# Altium schematic sheet DriverBoardForCNC.SchDoc: Driver Board For CNC
size A3; Author: veres; CompanyName: VR; DrawnBy: Vladimir; Engineer: Vladimir; Organization: Vladimir Tyrkin; Address1: veres.pcb@gmail.com; DocumentNumber: 001; Revision: 2.0; SheetNumber: 1; SheetTotal: 1
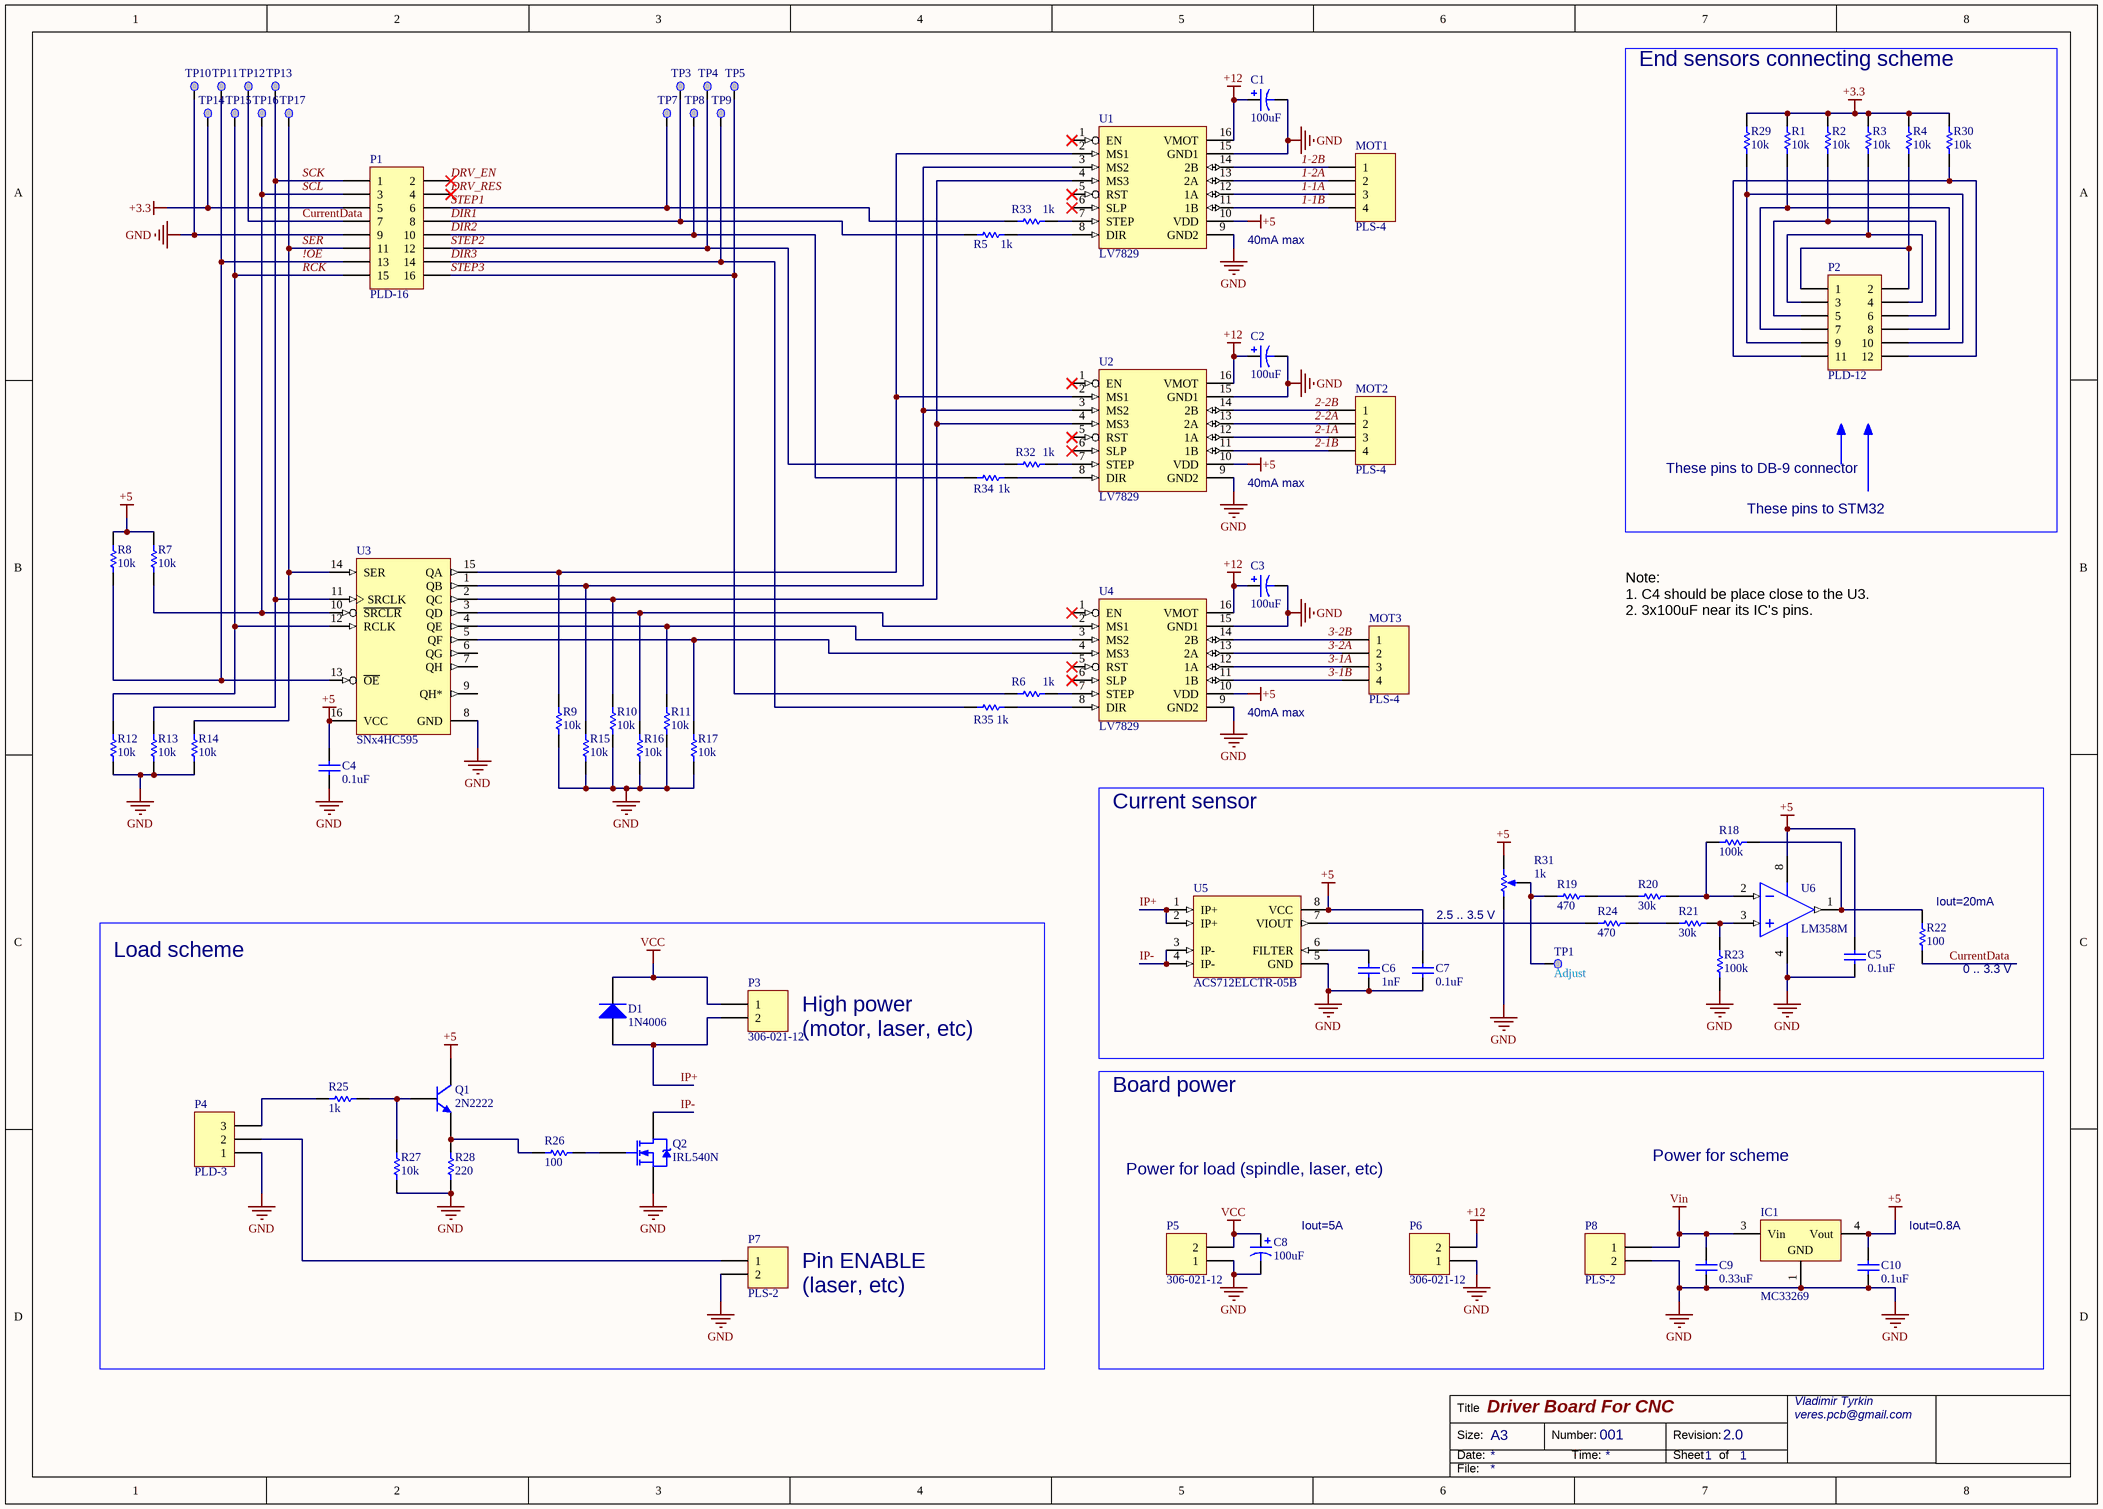
[diagram p0: DriverBoardForCNC.SchDoc]

## Parts
C1  value 100uF  [UD-6,3X5,8_NICHICON]  (hidden comment: Cap Pol)
C2  value 100uF  [UD-6,3X5,8_NICHICON]  (hidden comment: Cap Pol)
C3  value 100uF  [UD-6,3X5,8_NICHICON]  (hidden comment: Cap Pol)
C4  value 0.1uF  [C1206]  (hidden comment: Cap)
C5  value 0.1uF  [C1206]  (hidden comment: Cap)
C6  value 1nF  [C0805]  (hidden comment: Cap)
C7  value 0.1uF  [C1206]  (hidden comment: Cap)
C8  value 100uF  [UD-6,3X5,8_NICHICON]  (hidden comment: Cap Pol)
C9  value 0.33uF  [C1206]  (hidden comment: Cap)
C10  value 0.1uF  [C1206]  (hidden comment: Cap)
D1  1N4006  [DO-41]
IC1  MC33269  [DPAK]
MOT1  PLS-4  [HDR1X4]
MOT2  PLS-4  [HDR1X4]
MOT3  PLS-4  [HDR1X4]
P1  PLD-16  [HDR2X8]
P2  PLD-12  [HDR2X6]
P3  306-021-12  [W237-102]
P4  PLD-3  [HDR1X3]
P5  306-021-12  [W237-102]
P6  306-021-12  [W237-102]
P7  PLS-2  [HDR1X2]
P8  PLS-2  [HDR1X2]
Q1  2N2222  [TO92]
Q2  IRL540N  [TO220BV]
R1  10k  [RES-0805]
R2  10k  [RES-0805]
R3  10k  [RES-0805]
R4  10k  [RES-0805]
R5  1k  [RES-0805]
R6  1k  [RES-0805]
R7  10k  [RES-0805]
R8  10k  [RES-0805]
R9  10k  [RES-0805]
R10  10k  [RES-0805]
R11  10k  [RES-0805]
R12  10k  [RES-0805]
R13  10k  [RES-0805]
R14  10k  [RES-0805]
R15  10k  [RES-0805]
R16  10k  [RES-0805]
R17  10k  [RES-0805]
R18  100k  [RES-0805]
R19  470  [RES-0805]
R20  30k  [RES-0805]
R21  30k  [RES-0805]
R22  100  [RES-0805]
R23  100k  [RES-0805]
R24  470  [RES-1206]
R25  1k  [RES-0805]
R26  100  [RES-0805]
R27  10k  [RES-0805]
R28  220  [RES-0805]
R29  10k  [RES-0805]
R30  10k  [RES-0805]
R31  1k  [VR5]
R32  1k  [RES-0805]
R33  1k  [RES-0805]
R34  1k  [RES-0805]
R35  1k  [RES-0805]
TP1  Adjust  [TestPoint]  (no BOM)
TP3  (no value)  [TP_SMD_1MM]  (no BOM)
TP4  (no value)  [TP_SMD_1MM]  (no BOM)
TP5  (no value)  [TP_SMD_1MM]  (no BOM)
TP7  (no value)  [TP_SMD_1MM]  (no BOM)
TP8  (no value)  [TP_SMD_1MM]  (no BOM)
TP9  (no value)  [TP_SMD_1MM]  (no BOM)
TP10  (no value)  [TP_SMD_1MM]  (no BOM)
TP11  (no value)  [TP_SMD_1MM]  (no BOM)
TP12  (no value)  [TP_SMD_1MM]  (no BOM)
TP13  (no value)  [TP_SMD_1MM]  (no BOM)
TP14  (no value)  [TP_SMD_1MM]  (no BOM)
TP15  (no value)  [TP_SMD_1MM]  (no BOM)
TP16  (no value)  [TP_SMD_1MM]  (no BOM)
TP17  (no value)  [TP_SMD_1MM]  (no BOM)
U1  LV7829  [LV8729_BREAKOUT]
U2  LV7829  [LV8729_BREAKOUT]
U3  SNx4HC595  [SO16]
U4  LV7829  [LV8729_BREAKOUT]
U5  value ACS712ELCTR-05B  [SO-8_L]  (hidden comment: Current Sensor)
U6  LM358M  [SO-8_L]

## Blocks framed on the sheet
End sensors connecting scheme: P2 R1-R4 R29 R30
Current sensor: C5-C7 R18-R24 R31 TP1 U5 U6
Load scheme: D1 P3 P4 P7 Q1 Q2 R25-R28
Board power: C8-C10 IC1 P5 P6 P8

## Nets
+3.3: P1.5 R1.1 R2.1 R3.1 R4.1 R29.1 R30.1 TP14.1
+5: C4.2 C5.1 C7.2 C10.2 IC1.4(Vout) Q1.1(C) R7.1 R8.1 R31.3(BOT) U1.10(VDD) U2.10(VDD) U3.16(VCC) U4.10(VDD) U5.8(VCC) U6.8(V+)
+12: C1.1 C2.1 C3.1 P6.2 U1.16(VMOT) U2.16(VMOT) U4.16(VMOT)
GND: C1.2 C2.2 C3.2 C4.1 C5.2 C6.1 C7.1 C8.2 C9.1 C10.1 IC1.1(GND) P1.9 P4.1 P5.1 P6.1 P7.2 P8.2 Q2.3(S) R9.2 R10.2 R11.2 R12.2 R13.2 R14.2 R15.2 R16.2 R17.2 R23.2 R27.2 R28.2 R31.1(TOP) TP10.1 U1.9(GND2) U1.15(GND1) U2.9(GND2) U2.15(GND1) U3.8(GND) U4.9(GND2) U4.15(GND1) U5.5(GND) U6.4(V-)
VCC: C8.1 D1.2(K) P3.1 P5.2
Vin: C9.2 IC1.3(Vin) P8.1
1-1A: MOT1.3 U1.12(1A)
1-1B: MOT1.4 U1.11(1B)
1-2A: MOT1.2 U1.13(2A)
1-2B: MOT1.1 U1.14(2B)
2-1A: MOT2.3 U2.12(1A)
2-1B: MOT2.4 U2.11(1B)
2-2A: MOT2.2 U2.13(2A)
2-2B: MOT2.1 U2.14(2B)
3-1A: MOT3.3 U4.12(1A)
3-1B: MOT3.4 U4.11(1B)
3-2A: MOT3.2 U4.13(2A)
3-2B: MOT3.1 U4.14(2B)
!OE: P1.13 R8.2 TP11.1 U3.13(~{OE})
CurrentData: P1.7 R22.2 TP12.1
DIR1: P1.8 R5.2 TP3.1
DIR2: P1.10 R34.2 TP8.1
DIR3: P1.14 R35.2 TP9.1
DRV_EN: P1.2
DRV_RES: P1.4
IP+: D1.1(A) P3.2 U5.1(IP+) U5.2(IP+)
IP-: Q2.2(D) U5.3(IP-) U5.4(IP-)
RCK: P1.15 R12.1 TP15.1 U3.12(RCLK)
SCK: P1.1 R13.1 TP13.1 U3.11(SRCLK)
SCL: P1.3 R7.2 TP16.1 U3.10(~{SRCLR})
SER: P1.11 R14.1 TP17.1 U3.14(SER)
STEP1: P1.6 R33.2 TP7.1
STEP2: P1.12 R32.2 TP4.1
STEP3: P1.16 R6.2 TP5.1
NetC6_2: C6.2 U5.6(FILTER)
NetP2_1: P2.1 P2.2 R4.2
NetP2_3: P2.3 P2.4 R3.2
NetP2_5: P2.5 P2.6 R2.2
NetP2_7: P2.7 P2.8 R1.2
NetP2_9: P2.9 P2.10 R29.2
NetP2_11: P2.11 P2.12 R30.2
NetP4_2: P4.2 P7.1
NetP4_3: P4.3 R25.2
NetQ1_2: Q1.2(B) R25.1 R27.1
NetQ1_3: Q1.3(E) R26.2 R28.1
NetQ2_1: Q2.1(G) R26.1
NetR5_1: R5.1 U1.8(DIR)
NetR6_1: R6.1 U4.7(STEP)
NetR9_1: R9.1 U1.2(MS1) U2.2(MS1) U3.15(QA)
NetR10_1: R10.1 U1.4(MS3) U2.4(MS3) U3.2(QC)
NetR11_1: R11.1 U3.4(QE) U4.3(MS2)
NetR15_1: R15.1 U1.3(MS2) U2.3(MS2) U3.1(QB)
NetR16_1: R16.1 U3.3(QD) U4.2(MS1)
NetR17_1: R17.1 U3.5(QF) U4.4(MS3)
NetR18_1: R18.1 R20.1 U6.2(IN-)
NetR18_2: R18.2 R22.1 U6.1(OUT)
NetR19_1: R19.1 R31.2(TAP) TP1.1
NetR19_2: R19.2 R20.2
NetR21_1: R21.1 R23.1 U6.3(IN+)
NetR21_2: R21.2 R24.2
NetR24_1: R24.1 U5.7(VIOUT)
NetR32_1: R32.1 U2.7(STEP)
NetR33_1: R33.1 U1.7(STEP)
NetR34_1: R34.1 U2.8(DIR)
NetR35_1: R35.1 U4.8(DIR)

Not connected (* = marked no-connect by the designer): U1 1(EN)* 5(RST)* 6(SLP)*; U2 1(EN)* 5(RST)* 6(SLP)*; U3 6(QG) 7(QH) 9(QH*); U4 1(EN)* 5(RST)* 6(SLP)*

## Notes on the sheet
- (near U1) 40mA max
- (near U2) 40mA max
- These pins to DB-9 connector
- These pins to STM32
- (near U4) 40mA max
- Note:
  1. C4 should be place close to the U3.
  2. 3x100uF near its IC's pins.
- (near R31) 2.5 .. 3.5 V
- (near R22) Iout=20mA
- (near R22) 0 .. 3.3 V
- High power
  (motor, laser, etc)
- Power for load (spindle, laser, etc)
- Power for scheme
- (near C8) Iout=5A
- Iout=0.8A
- Pin ENABLE
  (laser, etc)
- Title
- Size:
- Date:
- A3
- Number:
- Time:
- Revision:
- Sheet
- of
- File:

## Library data of the parts
C1-C3 C8 = Cap Pol1: Polarized Capacitor (Radial) 16V, 105°C, 20% 6.3x5.4mm; Manufacturer: JB; Manufacturer_Part_Number: JCL1C101M063054; CHIPIDIP-code: 9000565735
C4 C5 C7 C10 = Cap: Capacitor ceramic SMD; Manufacturer: Murata; Manufacturer_Part_Number: GRM319R71H104K; CHIPIDIP-code: 348319975; Part_Type: Capacitor
C6 = Cap: Capacitor ceramic SMD; Manufacturer: HOLYSTONECAPS; Manufacturer_Part_Number: MLCC1000pFX7R50V10%0805; CHIPIDIP-code: 40582; Part_Type: Capacitor
C9 = Cap: Capacitor ceramic SMD; Manufacturer: Murata; Manufacturer_Part_Number: GRM319R71H334KA01D; CHIPIDIP-code: 344025606; Part_Type: Capacitor
D1 = Diode 1N4004: 1 Amp General Purpose Rectifier; Manufacturer: DC COMPONENTS CO., LTD.; Part_Type: Diode, Axial; CHIPIDIP-code: 3519; ComponentLink1Description: Manufacturer Link; ComponentLink1URL: http://www.fairchildsemi.com/; ComponentLink2Description: Datasheet; ComponentLink2URL: http://www.fairchildsemi.com/ds/1N%2F1N4001.pdf; Value: 1N4006; Manufacturer_Part_Number: 1N4006
IC1 = Volt Reg 5V: 5V Voltage Regulator; Manufacturer_Part_Number: MC33269DT−5.0; Manufacturer: ON Semiconductor; CHIPIDIP-code: 563066499; Value: MC33269; Part_Type: Voltage regulator
MOT1-MOT3 = Header 4: Header, 4-Pin; Manufacturer: Connfly; Manufacturer_Part_Number: DS1021-1*4SF11-B; Part_Type: Connector; CHIPIDIP-code: 174993133; Value2: (DS1021-1x4); Value: PLS-4
P1 = Header 8X2: Header, 8-Pin, Dual row; Manufacturer: Connfly; Manufacturer_Part_Number: DS1021-2*8SF11-B; Part_Type: Connector; CHIPIDIP-code: 4114; Value2: (DS1021-2x8); Value: PLD-16
P2 = Header 6X2: Header, 6-Pin, Dual row; Manufacturer: Connfly; Manufacturer_Part_Number: DS1021-2*6SF11-B; Part_Type: Connector; CHIPIDIP-code: none; Value2: DS1021-2x6; Value: PLD-12
P3 P5 P6 = Header 2: Screw connector, 2-Pin; Manufacturer: Ningbo Xinya M&E; Manufacturer_Part_Number: XY306A-5.0-2P-12; CHIPIDIP-code: 43112; Part_Type: Connector; Value: 306-021-12
P4 = Header 3: Header, 3-Pin; Manufacturer: Connfly; Manufacturer_Part_Number: DS1021-1*3SF11-B; Part_Type: Connector; CHIPIDIP-code: 132511368; Value2: (DS1021-1x3); Value: PLD-3
P7 P8 = Header 2: Header, 2-Pin; Manufacturer: Connfly; Manufacturer_Part_Number: DS1021-1*2SF11-B; Part_Type: Connector; CHIPIDIP-code: 260750144; Value2: (DS1021-1x2); Value: PLS-2
Q1 = NPN: NPN Bipolar Transistor; Manufacturer: ON Semiconductor; Manufacturer_Part_Number: KSP2222ABU; CHIPIDIP-code: 363567003; Value: 2N2222; Part_Type: Transistor
Q2 = NMOS-2: N-Channel Power MOSFET; Manufacturer: Infineon Technologies; Part_Type: Transistor; Manufacturer_Part_Number: IRL540NPBF; CHIPIDIP-code: 387859736; ComponentLink1Description: Manufacturer Link; ComponentLink1URL: http://www.irf.com/; Value: IRL540N
R1-R4 R7-R17 R27 R29 R30 = Res: Rectangular Thick Film Chip Resistor; Manufacturer_Part_Number: RC0805FR-0710KL; Manufacturer: Yageo; CHIPIDIP-code: 9000079514; Note: If flow soldering, adjust pad width of PCB Footprint to 0.7 - 0.8 times the width of the resistor.; Part_Type: Resistor; ComponentLink1Description: Manufacturer Link; ComponentLink1URL: http://www.panasonic.com/industrial/components/resistive_products.htm; ComponentLink2Description: Datasheet; ComponentLink2URL: http://www.panasonic.com/industrial/components/pdf/AOA0000CE8.pdf; Value: 10k
R5 R6 R25 R32-R35 = Res: Rectangular Thick Film Chip Resistor; Manufacturer: Yageo; Manufacturer_Part_Number: RC0805FR-071KL; CHIPIDIP-code: 9000079486; Note: If flow soldering, adjust pad width of PCB Footprint to 0.7 - 0.8 times the width of the resistor.; Part_Type: Resistor; ComponentLink1Description: Manufacturer Link; ComponentLink1URL: http://www.panasonic.com/industrial/components/resistive_products.htm; ComponentLink2Description: Datasheet; ComponentLink2URL: http://www.panasonic.com/industrial/components/pdf/AOA0000CE8.pdf; Value: 1k
R18 R23 = Res: Rectangular Thick Film Chip Resistor; Manufacturer_Part_Number: RC0805FR-07100KL; Manufacturer: Yageo; Note: If flow soldering, adjust pad width of PCB Footprint to 0.7 - 0.8 times the width of the resistor.; CHIPIDIP-code: 9000079538; ComponentLink1Description: Manufacturer Link; ComponentLink1URL: http://www.panasonic.com/industrial/components/resistive_products.htm; ComponentLink2Description: Datasheet; ComponentLink2URL: http://www.panasonic.com/industrial/components/pdf/AOA0000CE8.pdf; Value: 100k; Part_Type: Resistor
R19 = Res: Rectangular Thick Film Chip Resistor; Manufacturer_Part_Number: RC0805FR-07470RL; Manufacturer: Yageo; CHIPIDIP-code: 9000079478; Note: If flow soldering, adjust pad width of PCB Footprint to 0.7 - 0.8 times the width of the resistor.; Part_Type: Resistor; ComponentLink1Description: Manufacturer Link; ComponentLink1URL: http://www.panasonic.com/industrial/components/resistive_products.htm; ComponentLink2Description: Datasheet; ComponentLink2URL: http://www.panasonic.com/industrial/components/pdf/AOA0000CE8.pdf; Value: 470
R20 R21 = Res: Rectangular Thick Film Chip Resistor; Manufacturer_Part_Number: RC0805FR-0730KL; Manufacturer: Yageo; Note: If flow soldering, adjust pad width of PCB Footprint to 0.7 - 0.8 times the width of the resistor.; CHIPIDIP-code: 9000079525; ComponentLink1Description: Manufacturer Link; ComponentLink1URL: http://www.panasonic.com/industrial/components/resistive_products.htm; ComponentLink2Description: Datasheet; ComponentLink2URL: http://www.panasonic.com/industrial/components/pdf/AOA0000CE8.pdf; Value: 30k; Part_Type: Resistor
R22 = Res: Rectangular Thick Film Chip Resistor; Manufacturer_Part_Number: RC0805FR-07100RL; Manufacturer: Yageo; Note: If flow soldering, adjust pad width of PCB Footprint to 0.7 - 0.8 times the width of the resistor.; CHIPIDIP-code: 9000079462; ComponentLink1Description: Manufacturer Link; ComponentLink1URL: http://www.panasonic.com/industrial/components/resistive_products.htm; ComponentLink2Description: Datasheet; ComponentLink2URL: http://www.panasonic.com/industrial/components/pdf/AOA0000CE8.pdf; Value: 100; Part_Type: Resistor
R24 = Res: Rectangular Thick Film Chip Resistor; Manufacturer_Part_Number: RC1206FR-07470RL; Manufacturer: Yageo; CHIPIDIP-code: 9000079907; Note: If flow soldering, adjust pad width of PCB Footprint to 0.7 - 0.8 times the width of the resistor.; Part_Type: Resistor; ComponentLink1Description: Manufacturer Link; ComponentLink1URL: http://www.panasonic.com/industrial/components/resistive_products.htm; ComponentLink2Description: Datasheet; ComponentLink2URL: http://www.panasonic.com/industrial/components/pdf/AOA0000CE8.pdf; Value: 470
R26 = Res: Rectangular Thick Film Chip Resistor; Manufacturer_Part_Number: RC0805FR-07100RL; Manufacturer: Yageo; CHIPIDIP-code: 9000079462; Note: If flow soldering, adjust pad width of PCB Footprint to 0.7 - 0.8 times the width of the resistor.; Part_Type: Resistor; ComponentLink1Description: Manufacturer Link; ComponentLink1URL: http://www.panasonic.com/industrial/components/resistive_products.htm; ComponentLink2Description: Datasheet; ComponentLink2URL: http://www.panasonic.com/industrial/components/pdf/AOA0000CE8.pdf; Value: 100
R28 = Res: Rectangular Thick Film Chip Resistor; Manufacturer_Part_Number: RC0805FR-07220RL; Manufacturer: Yageo; CHIPIDIP-code: 9000079470; Note: If flow soldering, adjust pad width of PCB Footprint to 0.7 - 0.8 times the width of the resistor.; Part_Type: Resistor; ComponentLink1Description: Manufacturer Link; ComponentLink1URL: http://www.panasonic.com/industrial/components/resistive_products.htm; ComponentLink2Description: Datasheet; ComponentLink2URL: http://www.panasonic.com/industrial/components/pdf/AOA0000CE8.pdf; Value: 220
R31 = RPot: Potentiometer; Manufacturer_Part_Number: 3296W-1-102LF; Manufacturer: Bourns; CHIPIDIP-code: 4464; Set Position: 0.5; Part_Type: Potentiometer; Value: 1k
TP1 TP3-TP5 TP7-TP17 = Test Point: Part_Type: Mechanical; Status: Released; Manufacturer_Part_Number: n/a; Manufacturer: n/a; ComponentLink1Description: Datasheet; ComponentLink1URL: http://na
  TP1: Value: Adjust
U1 U2 U4 = LV7829: Stepper motor driver; Manufacturer_Part_Number: LV7829 Module; Manufacturer: China; CHIPIDIP-code: none; ComponentLink1Description: Datasheet; Part_Type: Driver; ComponentLink1URL: http://tunmcdsvn.tun.st.com/Component_Datasheet_Library/Trunk/Diodes/STM_ESD_ESDA6V1BC6; Value: LV7829; Component_Link: https://aliexpress.ru/item/32881945086.html?_ga=2.148448563.506267163.1640105170-654681520.1604340042&_gac=1.114864501.1639346332.Cj0KCQiA2NaNBhDvARIsAEw55hg0RpnmDiEVLwfBwV1DBwQRRzTZISLV43c0hEMg0tSMQHOqo776kiQaArGpEALw_wcB&sku_id=65626866361&spm=a2g39.orderlist.0.0.68c74aa6SGBVzg
  U1: ComponentLink: *
U3 = SNx4HC595: 8-bit shift register with 3-state output register; Manufacturer_Part_Number: SN74HC595D; Manufacturer: TI; CHIPIDIP-code: 37776; ComponentLink1Description: Datasheet; Part_Type: Shift register; ComponentLink1URL: http://tunmcdsvn.tun.st.com/Component_Datasheet_Library/Trunk/Diodes/STM_ESD_ESDA6V1BC6; Value: SNx4HC595
U5 = ACS712ELCTR-05B: Hall-Effect-Based Linear Current Sensor +-5A; Manufacturer: Allegro; CHIPIDIP-code: 9000043254; Manufacturer_Part_Number: ACS712ELCTR-05B; ComponentLink1Description: Datasheet; Part_Type: Sensor; ComponentLink1URL: http://tunmcdsvn.tun.st.com/Component_Datasheet_Library/Trunk/Diodes/STM_ESD_ESDA6V1BC6
U6 = Op Amp: FET Operational Amplifier; Manufacturer_Part_Number: LM358M/NOPB; Part_Type: OpAmp; Manufacturer: TI; CHIPIDIP-code: 39253; ComponentLink1Description: Manufacturer Link; ComponentLink1URL: http://www.analog.com/; Value: LM358M